# EAGLE design petitAVR-v1 (EAGLE 6.5.0)
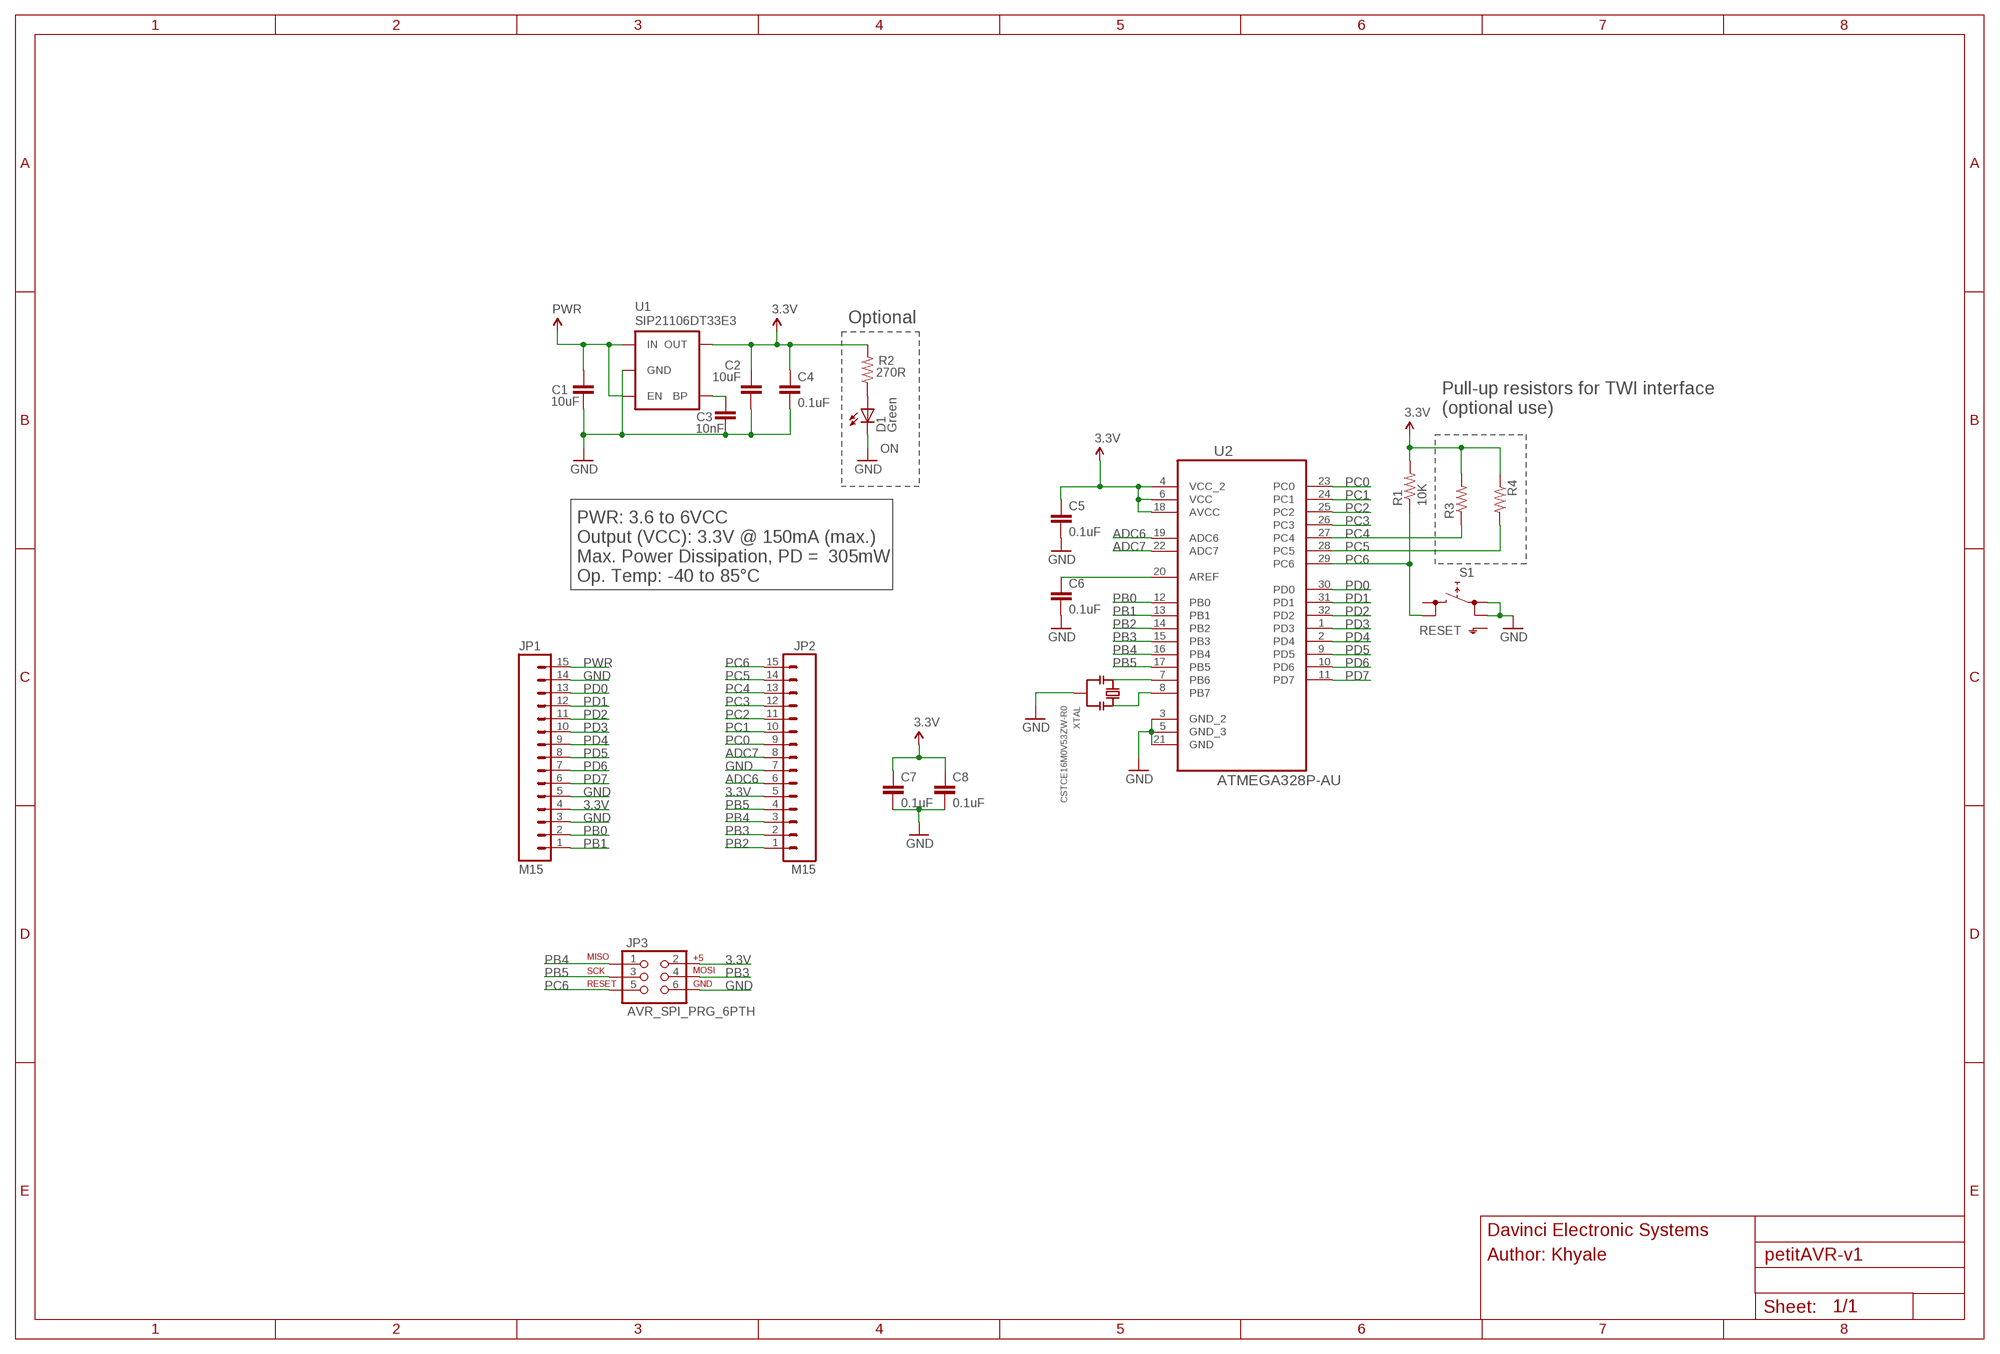
[diagram p0: schematic, sheet 1]

## Parts
C1  10uF  CAP0805  [0805]
C2  10uF  CAP0805  [0805]
C3  10nF  CAP0805  [0805]
C4  0.1uF  CAP0603-CAP  [0603-CAP]
C5  0.1uF  CAP0603-CAP  [0603-CAP]
C6  0.1uF  CAP0603-CAP  [0603-CAP]
C7  0.1uF  CAP0603-CAP  [0603-CAP]
C8  0.1uF  CAP0603-CAP  [0603-CAP]
D1  Green  LED0603  [LED-0603]
JP1  M15  [1X15]
JP2  M15  [1X15]
JP3  AVR_SPI_PRG_6PTH  [2X3]
R1  10K  RESISTOR0603  [0603-RES]
R2  270R  RESISTOR0805-RES  [0805]
R3  RESISTOR0603-RES  [0603-RES]
R4  RESISTOR0603  [0603-RES]
S1  RESET  SKHMPSE010  [SKHMPXE010]
U1  SIP21106DT33E3  V_REG_LDOSMD  [SOT23-5]
U2  ATMEGA328P-AU  [QFP80P900X900X120-32N]
XTAL  CSTCE16M0V53ZW-R0  [CSTCE_V]

## Nets
3.3V: C2.2 C4.1 C5.1 C7.1 C8.1 JP1.4 JP2.5 JP3.2 R1.2 R2.2 R3.2 R4.1 U1.5(OUT) U2.4(VCC_2) U2.6(VCC) U2.18(AVCC)
ADC6: JP2.6 U2.19(ADC6)
ADC7: JP2.8 U2.22(ADC7)
GND: C1.1 C2.1 C3.1 C4.2 C5.2 C6.2 C7.2 C8.2 D1.C JP1.3 JP1.5 JP1.14 JP2.7 JP3.6 S1.1(1.1) S1.2(1.2) U1.2(GND) U2.3(GND_2) U2.5(GND_3) U2.21(GND) XTAL.P2
N$1: D1.A R2.1
N$2: U2.7(PB6) XTAL.P3
N$3: U2.8(PB7) XTAL.P1
N$4: C3.2 U1.4(BP)
N$6: C6.1 U2.20(AREF)
PB0: JP1.2 U2.12(PB0)
PB1: JP1.1 U2.13(PB1)
PB2: JP2.1 U2.14(PB2)
PB3: JP2.2 JP3.4 U2.15(PB3)
PB4: JP2.3 JP3.1 U2.16(PB4)
PB5: JP2.4 JP3.3 U2.17(PB5)
PC0: JP2.9 U2.23(PC0)
PC1: JP2.10 U2.24(PC1)
PC2: JP2.11 U2.25(PC2)
PC3: JP2.12 U2.26(PC3)
PC4: JP2.13 R3.1 U2.27(PC4)
PC5: JP2.14 R4.2 U2.28(PC5)
PC6: JP2.15 JP3.5 R1.1 S1.4(2.2) U2.29(PC6)
PD0: JP1.13 U2.30(PD0)
PD1: JP1.12 U2.31(PD1)
PD2: JP1.11 U2.32(PD2)
PD3: JP1.10 U2.1(PD3)
PD4: JP1.9 U2.2(PD4)
PD5: JP1.8 U2.9(PD5)
PD6: JP1.7 U2.10(PD6)
PD7: JP1.6 U2.11(PD7)
PWR: C1.2 JP1.15 U1.1(IN) U1.3(EN)
Unconnected: S1.3(2.1) S1.5(SH)

## Notes on the sheet
- Optional
- Pull-up resistors for TWI interface
  (optional use)
- ON
- PWR: 3.6 to 6VCC
  Output (VCC): 3.3V @ 150mA (max.)
  Max. Power Dissipation, PD =  305mW
  Op. Temp: -40 to 85°C
- Davinci Electronic Systems
- Author: Khyale

## Library data of the parts
C1 C2 = SparkFun-Capacitors:CAP: Capacitor Standard 0603 ceramic capacitor, and 0.1" leaded capacitor.; MPN: LMK212AB7106MG-T; SUPPLIER: Taiyo Yuden
C3 = SparkFun-Capacitors:CAP: Capacitor Standard 0603 ceramic capacitor, and 0.1" leaded capacitor.; MPN: VJ0805Y103JXQCW1BC; SUPPLIER: Vishay / Vitramon
C4-C8 = SparkFun-Passives:CAP: Capacitor Standard 0603 ceramic capacitor, and 0.1" leaded capacitor.; MPN: VJ0603Y104KXJCW1BC; SUPPLIER: Vishay / Vitramon
D1 = SparkFun-LED:LED: LEDs Standard schematic elements and footprints for 5mm, 3mm, 1206, and 0603 sized LEDs. 5mm - Spark Fun Electronics SKU : COM-00529 (and others); MPN: VLMG1300-GS08; SUPPLIER: Vishay Semiconductors
JP1 JP2 = SparkFun-Connectors:M15: Header 15 Standard 15-pin 0.1" header. Use with straight break away headers (SKU : PRT-00116), right angle break away headers (PRT-00553), swiss pins (PRT-00743), machine pins (PRT-00117), and female headers (PRT-00115).; MPN: 22-28-4151; SUPPLIER: Molex
JP3 = SparkFun-Connectors:AVR_SPI_PRG_6: AVR ISP 6 Pin This is the reduced ISP connector for AVR programming. Common on Arduino. This footprint will take up less PCB space and can be used with a 10-pin to 6-pin adapter such as SKU: BOB-08508; MPN: 103328-3; SUPPLIER: TE Connectivity / AMP
R1 = SparkFun-Resistors:RESISTOR: Resistor Basic schematic elements and footprints for 0603, 1206, and PTH resistors.; MPN: ERJ-3EKF1002V; SUPPLIER: Panasonic
R2 = SparkFun-Resistors:RESISTOR: Resistor Basic schematic elements and footprints for 0603, 1206, and PTH resistors.; MPN: ERJ-6GEYJ271V; SUPPLIER: Panasonic
R3 R4 = SparkFun-Resistors:RESISTOR: Resistor Basic schematic elements and footprints for 0603, 1206, and PTH resistors.
S1 = te-switch:SKHMP*E010: 6.2 X 6.5mm TACT Switch (SMD) Source: http://www3.alps.co.jp/WebObjects/catalog.woa/PDF/E/Switch/Tact/SKHM/SKHM.PDF; MPN: FSM1LPATR; SUPPLIER: TE Connectivity / Alcoswitch
U1 = SparkFun-PowerIC:V_REG_LDO: Voltage Regulator LDO Standard 150mA LDO voltage regulator in SOT-23 layout. Micrel part MIC5205. BP (by-pass) pin is used to lower output noise with 470pF cap.; MPN: SIP21106DT-33-E3; SUPPLIER: Vishay / Siliconix
U2 = Atmel_By_element14_Batch_1:ATMEGA328P-AU: 8-bit Microcontroller with In-System Programmable Flash; MPN: ATMEGA328P-AU; OC_FARNELL: 1715486; OC_NEWARK: 14R4631; PACKAGE: TQFP-32; SUPPLIER: Atmel
XTAL = murata-ressonator:CSTCE16M0V53ZW-R0; MPN: CSTCE16M0V53ZW-R0; SUPPLIER: Murata Electronics

## Board
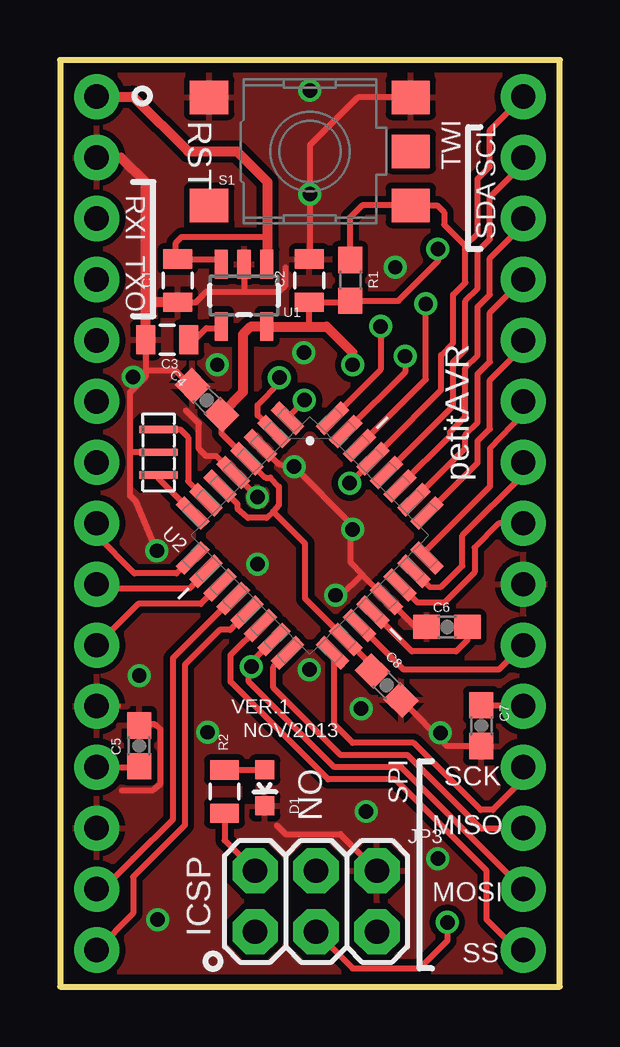
[diagram p1: board, top side]
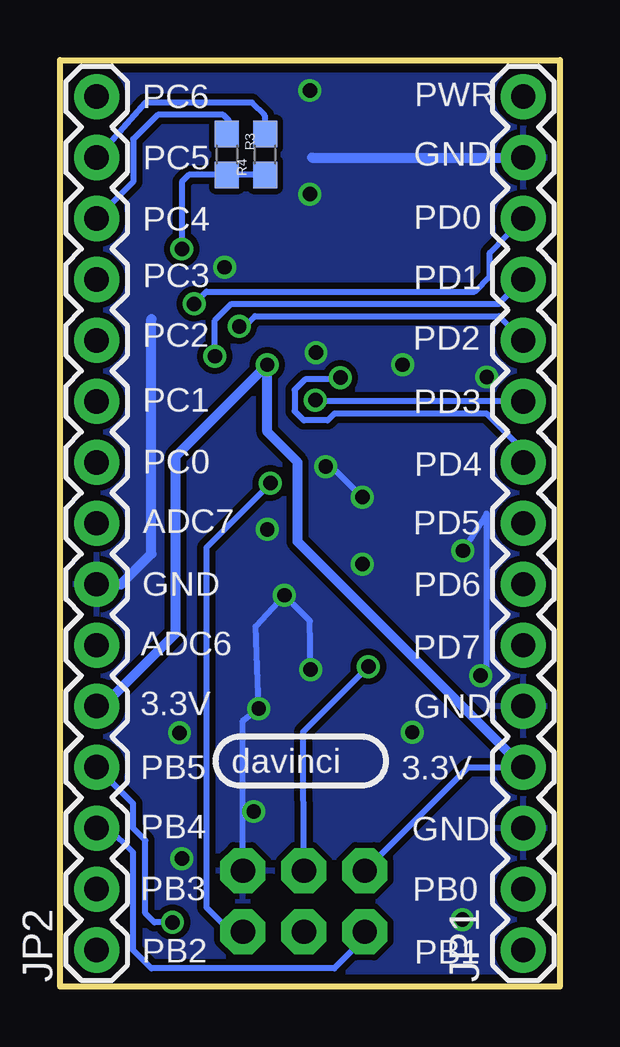
[diagram p2: board, bottom side, seen from below]

Size 20.83 x 38.61 mm. Coordinates in mm from the lower left corner, seen from the top.
Outline: 0,0 20.83,0 20.83,38.61 0,38.61 0,0
Copper layers (1*16): Top 0.0356mm / dielectric 1.5011mm / Bottom 0.0356mm
Design rules "oshpark": minimum track width 6mil, minimum drill 13mil, track to track 6mil, track to pad 6mil, pad to pad 6mil, via to via 6mil, smd to smd 6mil, copper to edge 15mil, drill to drill 6mil, minimum pad ring 7mil, minimum via ring 7mil, stop-mask expansion 3mil, vias tented up to drill 0mil, thermal gap 10mil

### Footprints (pad centres in the part's own frame; a part is rotated, then mirrored left to right if it is on the bottom)
0805 = smd 0.8 x 1.2: 1 -0.9,0; 2 0.9,0
0603-CAP = smd 1.1 x 1: 1 -0.85,0; 2 0.85,0
LED-0603 = smd 0.8 x 0.8: A 0,-0.75; C 0,0.75
1X15 = drill 1.016 pad 1.88: 1 0,0; 2 2.54,0; 3 5.08,0; 4 7.62,0; 5 10.16,0; 6 12.7,0; 7 15.24,0; 8 17.78,0; 9 20.32,0; 10 22.86,0; 11 25.4,0; 12 27.94,0; 13 30.48,0; 14 33.02,0; 15 35.56,0
2X3 = drill 1.016 pad 1.88 octagon: 1 0,0; 2 0,2.54; 3 2.54,0; 4 2.54,2.54; 5 5.08,0; 6 5.08,2.54
0603-RES = smd 1.1 x 1: 1 -0.85,0; 2 0.85,0
SKHMPXE010 = smd 1.6 x 1.4: 1 -4.2,2.25; 2 4.2,2.25; 3 -4.2,-2.25; 4 4.2,-2.25; 5 4.2,0
SOT23-5 = smd 0.55 x 1.2: 1 -0.95,-1.3; 2 0,-1.3; 3 0.95,-1.3; 4 0.95,1.3; 5 -0.95,1.3
QFP80P900X900X120-32N = smd 1.473 x 0.508: 1 -4.115,2.794; 2 -4.115,2.007; 3 -4.115,1.194; 4 -4.115,0.406; 5 -4.115,-0.406; 6 -4.115,-1.194; 7 -4.115,-2.007; 8 -4.115,-2.794; 17 4.115,-2.794; 18 4.115,-2.007; 19 4.115,-1.194; 20 4.115,-0.406; 21 4.115,0.406; 22 4.115,1.194; 23 4.115,2.007; 24 4.115,2.794 | smd 0.508 x 1.473: 9 -2.794,-4.115; 10 -2.007,-4.115; 11 -1.194,-4.115; 12 -0.406,-4.115; 13 0.406,-4.115; 14 1.194,-4.115; 15 2.007,-4.115; 16 2.794,-4.115; 25 2.794,4.115; 26 2.007,4.115; 27 1.194,4.115; 28 0.406,4.115; 29 -0.406,4.115; 30 -1.194,4.115; 31 -2.007,4.115; 32 -2.794,4.115
CSTCE_V = smd 0.3 x 1.6: P1 0.95,0; P2 0,0; P3 -0.95,0

### Placement (x,y rotation side)
C1  4.9,29.41 90 top
C2  10.39,29.41 270 top
C3  4.47,26.95 0 top
C4  6.12,24.43 135 top
C5  3.3,10.03 90 top
C6  16.13,14.99 180 top
C7  17.55,10.87 270 top
C8  13.61,12.55 315 top
D1  8.53,8.28 180 top
JP1  1.52,1.52 90 bottom
JP2  19.3,1.52 90 bottom
JP3  8.13,2.29 0 top
R1  12.09,29.43 270 top
R2  6.86,8.13 270 top
R3  13.88,34.67 270 bottom
R4  12.28,34.67 90 bottom
S1  10.41,34.8 0 top
U1  7.67,28.8 180 top
U2  10.41,18.8 315 top
XTAL  4.11,22.26 270 top

### Tracks (layer width: path | path; a pad name or v marks a point on that pad's centre or on a via)
3.3V  (via drill 0.6)
  Top 0.254: U2.18 11.92,14.44 11.92,14.31 12.07,14.29 | U2.18 10.21,16.16 10.21,18.46 8.88,19.79 | 6.66,21.03 U2.6 6.66,20.77 6.84,20.67 7.39,20.12 7.39,19.91 7.82,19.53 8.61,19.53 8.88,19.79 | U2.4 7.75,22.02 | 7.75,22.02 6.72,23.05 C4.1 6.77,23.92 | 8.64,27.49 U1.5 | 10.39,27.5 C2.2 12.12,28.51 R1.2 14.1,28.58 15.75,30.23 v15.75,30.73 | 7.75,22.02 8.56,21.21 8.76,21.21 9.12,20.83 9.12,20.07 8.88,19.79 | JP1.4 3.19,9.14 C5.1 | C8.1 12.73,13.64 U2.18 | C7.1 19.27,11.72 JP2.5 | R2.2 6.86,6.1 JP3.2
  Top 0.406: U1.5 10.39,27.5 11.1,27.5 12.19,26.42 v12.19,25.91 | 6.77,23.92 7.62,24.77 7.62,27.18 7.93,27.49 8.64,27.49
  Bottom 0.254: JP3.2 3.81,9.14 JP1.4 | v15.75,30.73 15.75,33.53 15.46,33.82 R3.2 R4.1
  Bottom 0.406: JP2.5 19.05,11.68 16,14.73 16,22.1 v12.19,25.91 12.19,23.11 10.92,21.84 10.92,18.54 JP1.4
ADC6
  Top 0.254: JP2.6 18.29,13.21 14.31,13.21 U2.19
ADC7
  Top 0.254: JP2.8 18.29,19.3 17.27,18.29 17.27,17.27 16,16 14.9,16 U2.22
GND  (via drill 0.6)
  Top 0.254: JP1.5 2.42,11.68 | C1.1 5.65,28.51 6.1,28.96 7.62,28.96 | 7.62,28.96 9.14,28.96 9.4,29.21 9.4,29.97 | U1.2 7.67,29.01 7.62,28.96 | S1.2 12.41,37.05 10.41,35.05 10.41,30.34 C2.1 | C3.1 3.57,25.65 | 3.57,25.65 3.57,25.41 2.92,24.77 2.92,22.26 | 5.26,24 5.79,23.47 5.79,22.4 6.1,22.1 6.5,22.1 7.17,21.43 U2.5 7.26,21.37 v8.23,20.4 | C4.2 5.44,25.04 4.83,25.65 3.57,25.65 | U2.3 8.39,22.5 9.12,21.77 v9.75,21.67 12.12,19.28 12.12,17.65 12.6,17.17 | 12.6,17.17 13.54,16.23 U2.21 14.8,14.99 C6.2 | v4.04,18.16 3.17,20.19 2.92,20.45 2.92,22.26 | XTAL.P2 2.92,22.26 | JP1.3 1.52,7.11 | 2.59,8.18 3.86,8.18 4.19,8.46 4.19,10.72 3.96,10.92 3.27,10.92 C5.2 | v11.48,16.31 11.68,16.26 12.6,17.17 | C7.2 16.14,10.02 C8.2 | 9.04,6.71 9.4,6.35 11.68,6.35 JP3.6
  Top 0.406: JP1.14 2.54,34.54 3.56,33.53 3.56,28.51 | 3.56,28.51 3.56,26.84 C3.1 | C1.1 3.56,28.51
  Bottom 0.254: v9.75,21.67 9.6,21.77 v8.23,20.4 | JP1.5 2.03,11.68 | 3.05,12.7 3.05,19.71 v4.04,18.16 | v10.39,13.21 10.41,15.24 v11.48,16.31 12.68,15.01 v12.55,11.58 13.21,11.07 JP3.6
  Bottom 0.406: JP2.7 18.29,16.76 17.02,18.03 17.02,27.81 | 10.34,34.54 JP1.14
  other vias: 15.75,5.33 10.16,26.42 13.97,29.97 8.23,17.6 4.06,2.79 6.15,10.6 3.3,12.95 10.41,37.34 15.85,10.57 10.41,33.02 3.05,25.4 12.19,19.05 6.55,25.91 12.75,7.3
  pour Bottom (isolate 0.254): 0,38.61 20.83,38.61 20.83,0 0,0 0,1.27
  pour Top (isolate 0.254): 0,38.61 20.83,38.61 20.83,0 0,0
N$1
  Top 0.254: R2.1 D1.A
N$2
  Top 0.254: XTAL.P3 5.01,23.21 5.33,22.89 5.33,21.06 U2.7
N$3
  Top 0.254: U2.8 5.49,19.78 4.11,21.17 XTAL.P1
N$4
  Top 0.254: 6.86,27.56 arc58 U1.4 6.65,27.43 6.1,27.43 5.61,26.95 C3.2
N$5
  cutout Top (isolate 0.254): 5.08,23.65 4.83,23.88 3.3,23.88 3.05,23.62 3.05,20.83 3.3,20.57 4.83,20.57 5.08,20.83
N$6
  Top 0.254: C6.1 16.98,14.44 16.51,13.97 14.66,13.97 U2.20
N$7
  cutout Top (isolate 0.254): 7.62,8.64 7.62,7.62 8.13,7.62 8.13,8.64
N$15
  cutout Top: 3.56,9.14 3.3,9.14 3.3,8.89 3.56,8.89
PB0
  Top 0.254: U2.12 7.19,16.18 4.7,13.69 4.7,6.96 3.05,5.33 1.78,4.06 JP1.2
PB1
  Top 0.254: U2.13 7.8,15.57 7.09,14.86 6.66,14.86 5.21,13.41 5.21,6.73 3.05,4.57 3.05,3.05 JP1.1
PB2
  Top 0.254: JP2.1 19.05,1.52 17.78,2.79 17.78,4.83 13.97,8.64 11.18,8.64 7.11,12.7 7.11,13.82 U2.14
PB3  (via drill 0.6)
  Top 0.254: JP2.2 14.22,9.14 11.43,9.14 7.87,12.7 7.87,13.23 v7.98,13.34 8.08,13.62 U2.15
  Bottom 0.254: JP3.4 10.69,10.62 v7.98,13.34
PB4
  Top 0.254: 9.48,13.89 U2.16 8.89,13.32 8.89,12.45 11.68,9.65 14.48,9.65 17.53,6.6 JP2.3
  Bottom 0.254: JP3.1 8.13,2.03 9.4,0.76 17.02,0.76 17.78,1.52 17.78,5.59 18.8,6.6 JP2.3
PB5  (via drill 0.6)
  Top 0.254: JP2.4 19.3,8.64 18.03,7.37 17.53,7.37 14.73,10.16 12.19,10.16 11.43,10.92 11.43,13.83 U2.17 | JP3.3 12.19,0.76 14.99,0.76 16.14,1.92 v16.14,2.68
  Bottom 0.254: JP2.4 17.78,7.62 17.78,6.6 17.27,6.1 17.27,3.05 16.9,2.68 v16.14,2.68
PC0
  Top 0.254: 14.74,17.26 U2.23 14.79,17.3 15.41,16.65 15.86,16.64 16.76,17.53 16.76,18.8 19.3,21.34 JP2.9
PC1
  Top 0.254: JP2.10 19.3,23.88 17.91,22.4 17.91,20.83 15.1,18.02 U2.24
PC2
  Top 0.254: U2.25 15.35,19.77 17.4,21.82 17.4,22.73 17.91,23.24 17.91,25.27 19.05,26.42 19.05,26.67 JP2.11
PC3
  Top 0.254: U2.26 14.77,20.3 16.89,22.43 16.89,22.99 17.4,23.5 17.4,25.53 17.91,26.04 17.91,28.07 JP2.12
PC4
  Top 0.254: U2.27 14.21,20.91 16.26,22.96 16.26,23.11 16.89,23.75 16.89,25.78 17.4,26.29 17.4,28.32 17.91,28.83 17.91,30.35 19.05,31.5 19.05,31.75 JP2.13
  Bottom 0.254: JP2.13 17.78,33.53 17.78,35.31 16.76,36.32 14.02,36.32 13.8,36.1 13.8,35.6 R3.1
PC5
  Top 0.254: U2.28 13.64,21.46 16.38,24.21 16.38,26.04 16.89,26.54 16.89,28.57 17.4,29.08 17.4,30.63 17.91,31.14 17.91,32.89 19.05,34.04 19.05,34.29 JP2.14
  Bottom 0.254: JP2.14 17.27,36.83 12.83,36.83 12.3,36.3 12.3,35.54 R4.2
PC6  (via drill 0.6)
  Top 0.254: 16.89,30.86 16.89,29.34 16.38,28.83 16.38,26.82 15.88,26.31 15.88,24.87 13.54,22.51 U2.29 13.04,21.93 v12.06,20.98 | 16.89,30.86 17.4,31.37 17.4,33.66 17.91,34.16 17.91,35.69 JP2.15 | R1.1 12.06,30.38 12.06,32.03 12.58,32.55 S1.4 15.71,32.55 16,32.26 16,31.75 16.89,30.86
  Bottom 0.254: v12.06,20.98 12.06,20.95 14.73,18.29 14.73,3.3 13.72,2.29 JP3.5
PD0  (via drill 0.6)
  Top 0.254: U2.30 12.59,22.65 15.24,25.3 v15.24,28.45
  Bottom 0.254: JP1.13 2.92,30.58 2.92,29.59 3.56,28.96 14.73,28.96 v15.24,28.45
PD1  (via drill 0.6)
  Top 0.254: U2.31 11.95,23.18 14.38,25.6 v14.38,26.26
  Bottom 0.254: v14.38,26.26 14.38,27.76 13.69,28.45 2.54,28.45 JP1.12
PD2  (via drill 0.6)
  Top 0.254: 11.41,23.78 11.41,23.76 U2.32 12.88,25.22 13.36,25.7 v13.36,27.51
  Bottom 0.254: v13.36,27.51 13.36,27.28 12.7,27.94 2.54,27.94 JP1.11
PD3  (via drill 0.6)
  Top 0.254: U2.1 9.48,23.73 v10.19,24.43
  Bottom 0.254: JP1.10 10.13,24.38 v10.19,24.43
PD4  (via drill 0.6)
  Top 0.254: U2.2 8.88,23.12 8.23,23.8 8.23,24.23 9.14,25.15 v9.14,25.38
  Bottom 0.254: JP1.9 1.52,22.35 3.05,23.88 9.4,23.88 9.68,23.6 10.67,23.6 11.05,23.98 11.05,24.87 10.62,25.3 9.42,25.3 v9.14,25.38
PD5
  Top 0.254: U2.9 5.52,17.86 4.85,17.22 3.1,17.22 1.52,18.8 JP1.8
PD6
  Top 0.254: U2.10 6,17.2 5.38,16.59 1.73,16.59 JP1.7
PD7
  Top 0.254: U2.11 6.6,16.68 5.87,15.95 3.25,15.95 JP1.6
PWR
  Top 0.254: 8.64,31.37 8.64,31.5 | 8.64,31.24 5.08,31.24 4.83,30.99 4.83,30.31 C1.2 6.72,30.31 U1.3
  Top 0.406: JP1.15 3.05,37.08 5.33,34.8 7.37,34.8 8.64,33.53 8.64,31.5 8.64,31.24 8.64,30.65 U1.1

### Text on the board
tPlace: RST | TWI | SCL | RXI | SDA | TXO | petitAVR | VER.1 | NOV/2013 | ON | SPI | SCK | MISO | MOSI | ICSP | SS
bPlace: PWR | PC6 | GND | PC5 | PD0 | PC4 | PD1 | PC3 | PD2 | PC2 | PD3 | PC1 | PD4 | PC0 | PD5 | ADC7 | PD6 | GND | PD7 | ADC6 | GND | 3.3V | 3.3V | davinci | PB5 | GND | PB4 | PB0 | PB3 | PB2 | PB1